# Altium schematic sheet Analog Inputs.SchDoc
size A4; Author: Thomas Kreppel; CompanyName: Universidad de Santiago de Chile; Address1: Avenida Ecuador Nº 3519; Address2: Estación Central, Santiago; Address3: Chile; DocumentNumber: 5; SheetNumber: 5; SheetTotal: 6
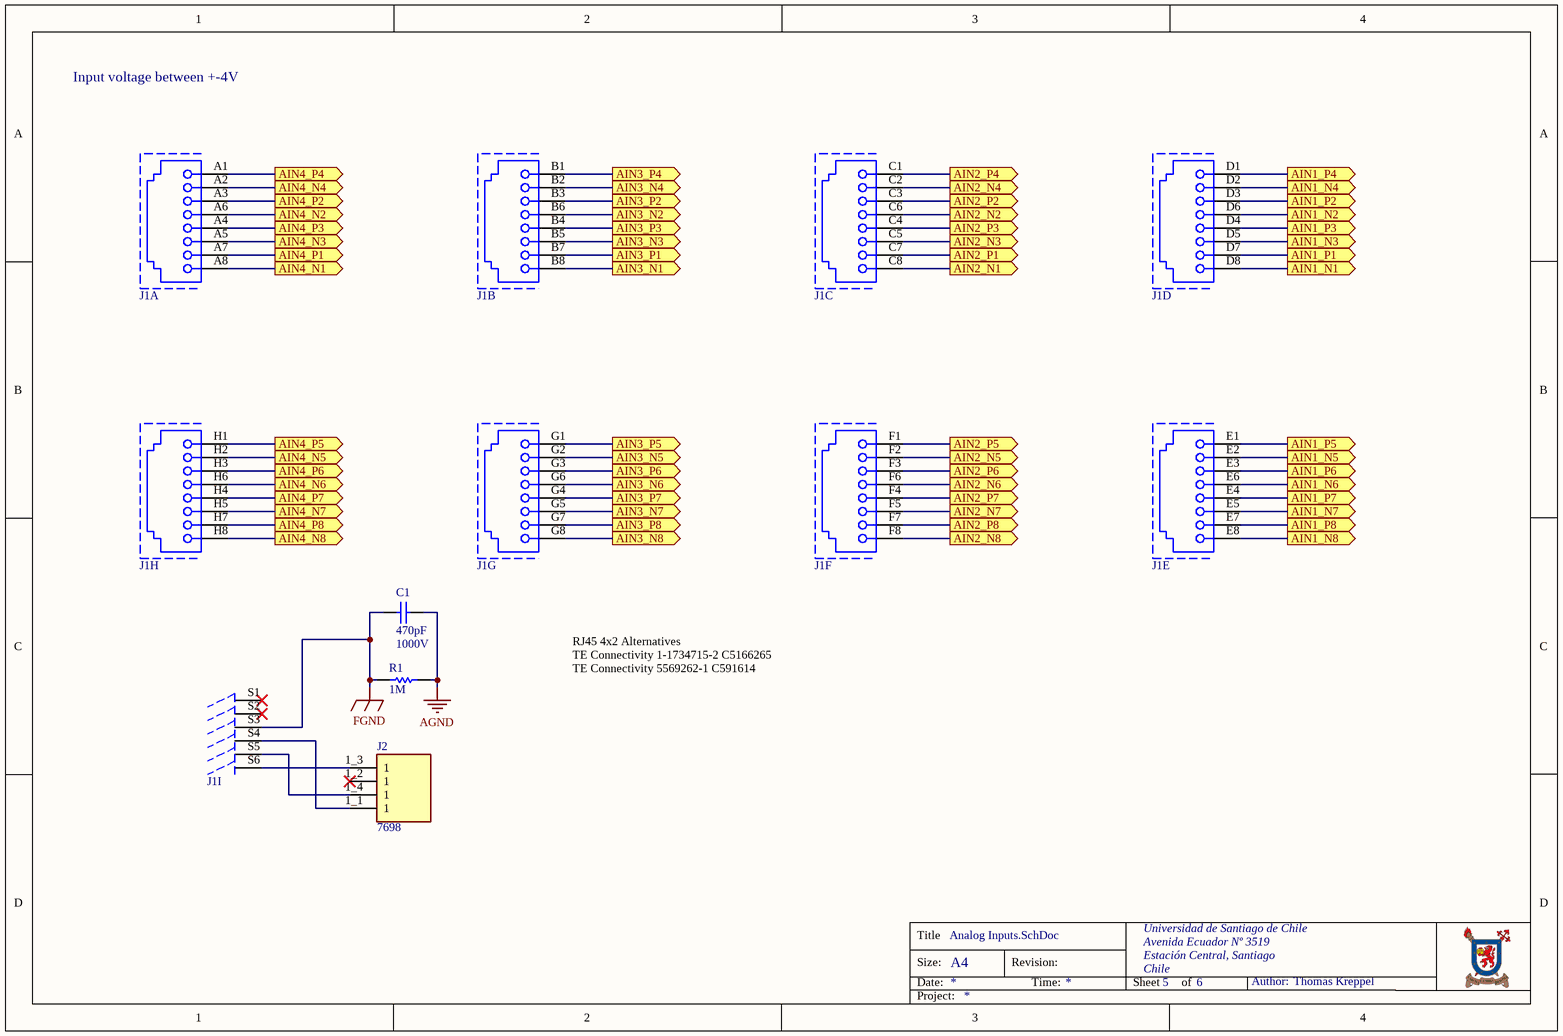
[diagram p0: Analog Inputs.SchDoc]

## Parts
C1  470pF  Voltage: 1000V  [RES_1206]
J1  Conector RJ-45 4x2  [RJ45 - 4x2]  (value not drawn)  (parts A,B,C,D,E,F,G,H,I of 9)
J2  7698  [KEYSTONE_7698]
R1  1M  [RES_1206]

## Ports
AIN1_N1 (out), AIN1_N2 (out), AIN1_N3 (out), AIN1_N4 (out), AIN1_N5 (out), AIN1_N6 (out), AIN1_N7 (out), AIN1_N8 (out), AIN1_P1 (out), AIN1_P2 (out), AIN1_P3 (out), AIN1_P4 (out), AIN1_P5 (out), AIN1_P6 (out), AIN1_P7 (out), AIN1_P8 (out), AIN2_N1 (out), AIN2_N2 (out), AIN2_N3 (out), AIN2_N4 (out), AIN2_N5 (out), AIN2_N6 (out), AIN2_N7 (out), AIN2_N8 (out), AIN2_P1 (out), AIN2_P2 (out), AIN2_P3 (out), AIN2_P4 (out), AIN2_P5 (out), AIN2_P6 (out), AIN2_P7 (out), AIN2_P8 (out), AIN3_N1 (out), AIN3_N2 (out), AIN3_N3 (out), AIN3_N4 (out), AIN3_N5 (out), AIN3_N6 (out), AIN3_N7 (out), AIN3_N8 (out), AIN3_P1 (out), AIN3_P2 (out), AIN3_P3 (out), AIN3_P4 (out), AIN3_P5 (out), AIN3_P6 (out), AIN3_P7 (out), AIN3_P8 (out), AIN4_N1 (out), AIN4_N2 (out), AIN4_N3 (out), AIN4_N4 (out), AIN4_N5 (out), AIN4_N6 (out), AIN4_N7 (out), AIN4_N8 (out), AIN4_P1 (out), AIN4_P2 (out), AIN4_P3 (out), AIN4_P4 (out), AIN4_P5 (out), AIN4_P6 (out), AIN4_P7 (out), AIN4_P8 (out)

## Nets
AGND: C1.2 R1.2
FGND: C1.1 J1.S3 R1.1
AIN1_N1: J1.D8 ; port AIN1_N1
AIN1_N2: J1.D6 ; port AIN1_N2
AIN1_N3: J1.D5 ; port AIN1_N3
AIN1_N4: J1.D2 ; port AIN1_N4
AIN1_N5: J1.E2 ; port AIN1_N5
AIN1_N6: J1.E6 ; port AIN1_N6
AIN1_N7: J1.E5 ; port AIN1_N7
AIN1_N8: J1.E8 ; port AIN1_N8
AIN1_P1: J1.D7 ; port AIN1_P1
AIN1_P2: J1.D3 ; port AIN1_P2
AIN1_P3: J1.D4 ; port AIN1_P3
AIN1_P4: J1.D1 ; port AIN1_P4
AIN1_P5: J1.E1 ; port AIN1_P5
AIN1_P6: J1.E3 ; port AIN1_P6
AIN1_P7: J1.E4 ; port AIN1_P7
AIN1_P8: J1.E7 ; port AIN1_P8
AIN2_N1: J1.C8 ; port AIN2_N1
AIN2_N2: J1.C6 ; port AIN2_N2
AIN2_N3: J1.C5 ; port AIN2_N3
AIN2_N4: J1.C2 ; port AIN2_N4
AIN2_N5: J1.F2 ; port AIN2_N5
AIN2_N6: J1.F6 ; port AIN2_N6
AIN2_N7: J1.F5 ; port AIN2_N7
AIN2_N8: J1.F8 ; port AIN2_N8
AIN2_P1: J1.C7 ; port AIN2_P1
AIN2_P2: J1.C3 ; port AIN2_P2
AIN2_P3: J1.C4 ; port AIN2_P3
AIN2_P4: J1.C1 ; port AIN2_P4
AIN2_P5: J1.F1 ; port AIN2_P5
AIN2_P6: J1.F3 ; port AIN2_P6
AIN2_P7: J1.F4 ; port AIN2_P7
AIN2_P8: J1.F7 ; port AIN2_P8
AIN3_N1: J1.B8 ; port AIN3_N1
AIN3_N2: J1.B6 ; port AIN3_N2
AIN3_N3: J1.B5 ; port AIN3_N3
AIN3_N4: J1.B2 ; port AIN3_N4
AIN3_N5: J1.G2 ; port AIN3_N5
AIN3_N6: J1.G6 ; port AIN3_N6
AIN3_N7: J1.G5 ; port AIN3_N7
AIN3_N8: J1.G8 ; port AIN3_N8
AIN3_P1: J1.B7 ; port AIN3_P1
AIN3_P2: J1.B3 ; port AIN3_P2
AIN3_P3: J1.B4 ; port AIN3_P3
AIN3_P4: J1.B1 ; port AIN3_P4
AIN3_P5: J1.G1 ; port AIN3_P5
AIN3_P6: J1.G3 ; port AIN3_P6
AIN3_P7: J1.G4 ; port AIN3_P7
AIN3_P8: J1.G7 ; port AIN3_P8
AIN4_N1: J1.A8 ; port AIN4_N1
AIN4_N2: J1.A6 ; port AIN4_N2
AIN4_N3: J1.A5 ; port AIN4_N3
AIN4_N4: J1.A2 ; port AIN4_N4
AIN4_N5: J1.H2 ; port AIN4_N5
AIN4_N6: J1.H6 ; port AIN4_N6
AIN4_N7: J1.H5 ; port AIN4_N7
AIN4_N8: J1.H8 ; port AIN4_N8
AIN4_P1: J1.A7 ; port AIN4_P1
AIN4_P2: J1.A3 ; port AIN4_P2
AIN4_P3: J1.A4 ; port AIN4_P3
AIN4_P4: J1.A1 ; port AIN4_P4
AIN4_P5: J1.H1 ; port AIN4_P5
AIN4_P6: J1.H3 ; port AIN4_P6
AIN4_P7: J1.H4 ; port AIN4_P7
AIN4_P8: J1.H7 ; port AIN4_P8
NetJ1_S4: J1.S4 J2.1_1(1)
NetJ1_S5: J1.S5 J2.1_4(1)
NetJ1_S6: J1.S6 J2.1_3(1)

Not connected (* = marked no-connect by the designer): J1 S1* S2*; J2 1_2(1)*

## Notes on the sheet
- Input voltage between +-4V
- RJ45 4x2 Alternatives
  TE Connectivity 1-1734715-2 C5166265
  TE Connectivity 5569262-1 C591614
- Title
- Size:
- Date:
- A4
- Revision:
- Time:
- Sheet
- of
- Author:
- Project:

## Library data of the parts
C1 = Cap_1206: Capacitor; MPN: 885342208017; MF: Würth Elektronik; Dielectricum: X7R; Tolerance: 10%; Supplier Part Number 1: 732-12097-1-ND; Value: 470pF; Supplier 1: Digikey; Package: 1206
J1 = Conector RJ-45 4x2: MPN: 5569262-1; MF: TE Connectivity; Supplier Part Number 1: A118195-ND; Supplier 1: Digikey; LCSC Part Number: C591614
J2 = 7698: Screw Terminal;Nickel;15 Amp;Snap-In;Vertical;Unassembled;M3 Thrd | Keystone Electronics 7698; SnapEDA_Link: https://www.snapeda.com/parts/7698/Keystone/view-part/?ref=snap; Package: None; Value: *; MF: Keystone; MP: 7698; Check_prices: https://www.snapeda.com/parts/7698/Keystone/view-part/?ref=eda; LCSC Part Number: C6708741
R1 = Res1206: Resistor; MPN: RC1206FR-071ML; MF: Yageo; Tolerance: 1%; Supplier Part Number 1: 311-1.00MFRCT-ND; Value: 1M; Supplier 1: Digikey; Package: 1206